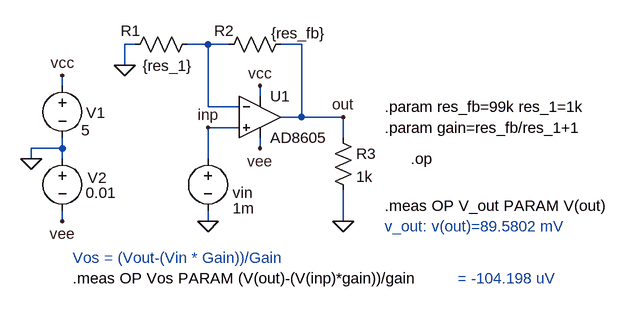
[diagram p0: schematic 03-AD8605 Vos invert amplifier - Copy.asc]
03-AD8605 Vos invert amplifier - Copy.asc, the LTspice schematic file:
Version 4
SHEET 1 880 680
WIRE -144 32 -160 32
WIRE -32 32 -64 32
WIRE 0 32 -32 32
WIRE 112 32 80 32
WIRE -160 64 -160 32
WIRE -256 96 -256 80
WIRE 48 112 48 96
WIRE -32 128 -32 32
WIRE 16 128 -32 128
WIRE 112 144 112 32
WIRE 112 144 80 144
WIRE 176 144 112 144
WIRE 16 160 -32 160
WIRE 176 176 176 144
WIRE -256 192 -256 176
WIRE -256 192 -304 192
WIRE 48 192 48 176
WIRE -304 208 -304 192
WIRE -256 208 -256 192
WIRE -32 208 -32 160
WIRE -256 304 -256 288
WIRE -32 304 -32 288
WIRE 176 304 176 256
FLAG -256 80 vcc
FLAG 48 96 vcc
FLAG -32 304 0
FLAG 176 304 0
FLAG 176 144 out
FLAG -32 160 inp
FLAG -304 208 0
FLAG -256 304 vee
FLAG 48 192 vee
FLAG -160 64 0
SYMBOL Opamps\\AD8605 48 80 R0
SYMATTR InstName U1
SYMBOL voltage -256 80 R0
WINDOW 123 0 0 Left 0
WINDOW 39 0 0 Left 0
WINDOW 0 37 57 Left 2
WINDOW 3 29 84 Left 2
SYMATTR InstName V1
SYMATTR Value 5
SYMBOL voltage -32 192 R0
WINDOW 123 0 0 Left 0
WINDOW 39 0 0 Left 0
WINDOW 0 38 68 Left 2
WINDOW 3 38 92 Left 2
SYMATTR InstName vin
SYMATTR Value 1m
SYMBOL res 160 160 R0
SYMATTR InstName R3
SYMATTR Value 1k
SYMBOL voltage -256 192 R0
WINDOW 123 0 0 Left 0
WINDOW 39 0 0 Left 0
WINDOW 0 39 45 Left 2
WINDOW 3 36 68 Left 2
SYMATTR InstName V2
SYMATTR Value 0.01
SYMBOL res 96 16 R90
WINDOW 0 11 103 VBottom 2
WINDOW 3 -17 -11 VTop 2
SYMATTR InstName R2
SYMATTR Value {res_fb}
SYMBOL res -48 16 R90
WINDOW 0 11 103 VBottom 2
WINDOW 3 33 46 VTop 2
SYMATTR InstName R1
SYMATTR Value {res_1}
TEXT 240 280 Left 2 !.meas OP V_out PARAM V(out)
TEXT 240 312 Left 2 ;v_out: v(out)=89.5802 mV
TEXT 280 208 Left 2 !.op
TEXT -240 360 Left 2 ;Vos = (Vout-(Vin * Gain))/Gain
TEXT 240 128 Left 2 !.param res_fb=99k res_1=1k
TEXT -240 392 Left 2 !.meas OP Vos PARAM (V(out)-(V(inp)*gain))/gain
TEXT 240 160 Left 2 !.param gain=res_fb/res_1+1
TEXT 352 392 Left 2 ;= -104.198 uV

The netlist it stands for:
* 03-AD8605 Vos invert amplifier - Copy.asc
XU1 inp N001 vcc vee out AD8605  ; pins In+ In- V+ V- OUT
V1 vcc 0 5
vin inp 0 1m
R3 out 0 1k
V2 0 vee 0.01
R2 out N001 {res_fb}
R1 N001 0 {res_1}
.meas OP V_out PARAM V(out)
* v_out: v(out)=89.5802 mV
.op
* Vos = (Vout-(Vin * Gain))/Gain
.param res_fb=99k res_1=1k
.meas OP Vos PARAM (V(out)-(V(inp)*gain))/gain
.param gain=res_fb/res_1+1
* = -104.198 uV
.lib ADI.lib
.backanno
.end